# Altium project ASM2464PD USB4 to PCIe M.2.PrjPcb
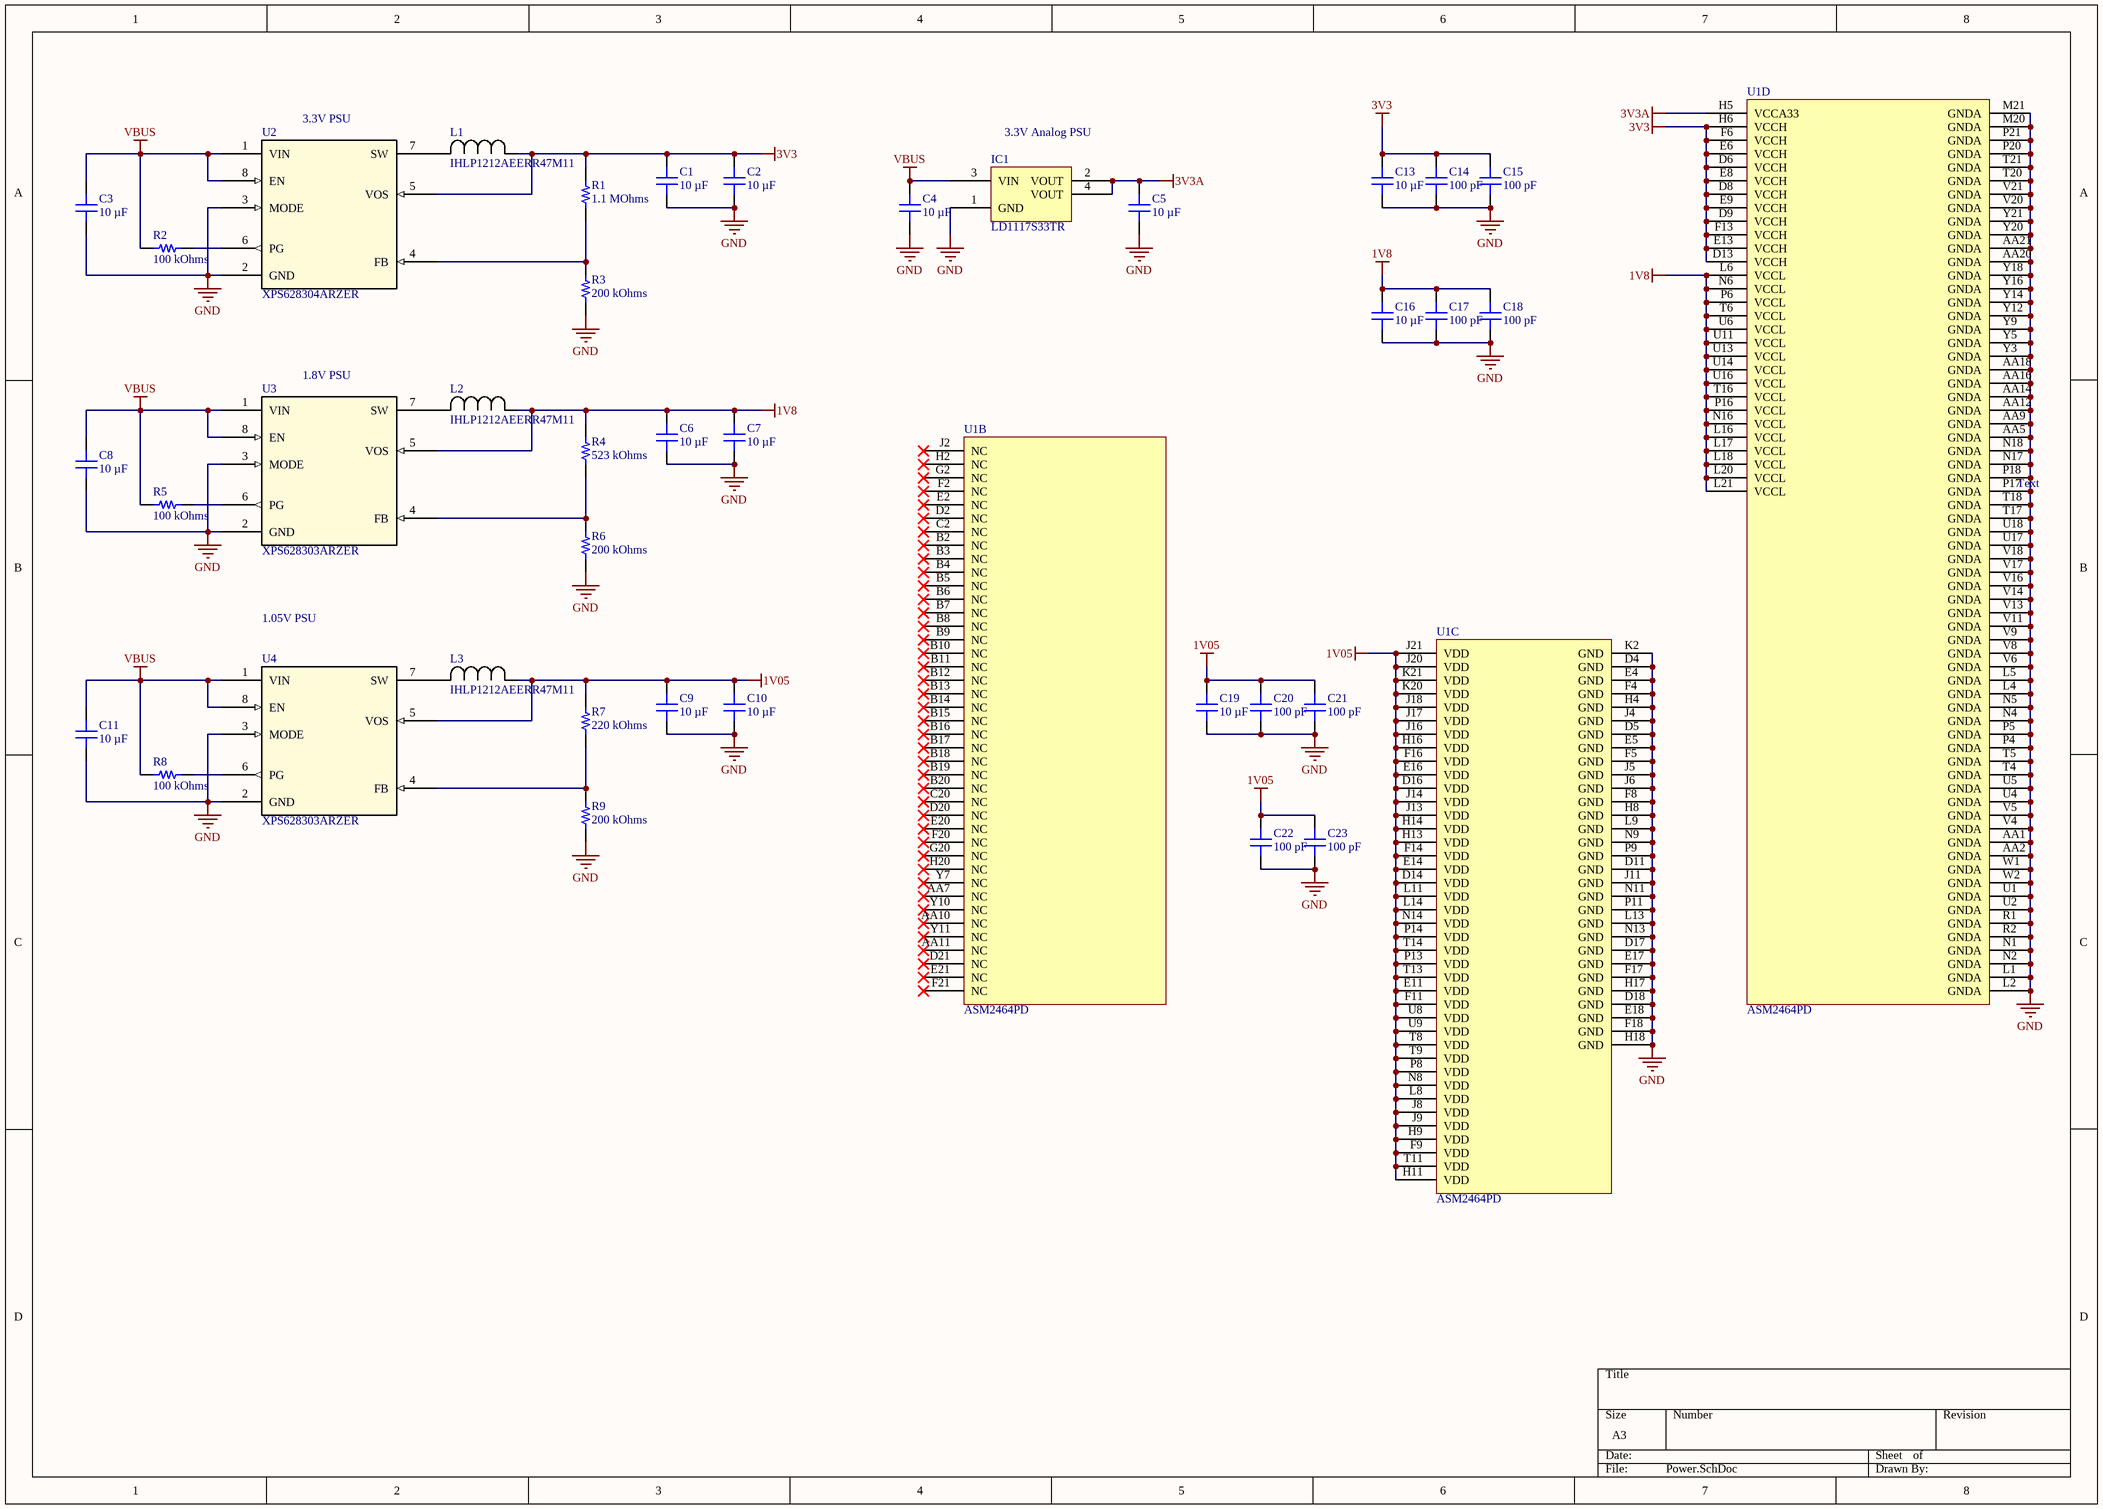
[diagram p0: Power.SchDoc]
CAGE_CODE: ?????; CONTRACT_NUMBER: <CONTRACT NO>; DOC_NO_ASSY_DWG: <ASSY DWG NO>; DOC_NO_BOM: <BOM DOC NO>; DOC_NO_FAB_DWG: <FAB DWG NO>; DOC_NO_SCH_DWG: <SCH DWG NO>; PCB_2_DEC_TOL: +/-.01; PCB_3_DEC_TOL: +/-.010; PCB_ANG_TOL: +/-1/2; PCB_ASSEMBLY_NO: <PCB ASSY NO>; PCB_CHECKER: - -----; PCB_CHECKER_APP_DATE: --/--/----; PCB_DESIGNER: - -----; PCB_DESIGNER_APP_DATE: --/--/----; PCB_DWG_NO: <PCB DWG NO>; PCB_ENGINEER: - -----; PCB_ENGINEER_APP_DATE: --/--/----; PCB_PART_NUMBER: <PCB PN>; PCB_REV: A; SCH_REV: A
2 sheets, 68 parts. Net scope: global (net labels, ports and power ports of the same name join across sheets).
Board file: PCB2.PcbDoc
Sheets:
  Power.SchDoc
  Main.SchDoc

## Sheet Power.SchDoc
size A3; SheetNumber: 1; SheetTotal: 2

### Parts
C1  10 µF  [CAP 0805_2012]
C2  10 µF  [CAP 0805_2012]
C3  10 µF  [CAP 0805_2012]
C4  10 µF  [CAP 0805_2012]
C5  10 µF  [CAP 0805_2012]
C6  10 µF  [CAP 0805_2012]
C7  10 µF  [CAP 0805_2012]
C8  10 µF  [CAP 0805_2012]
C9  10 µF  [CAP 0805_2012]
C10  10 µF  [CAP 0805_2012]
C11  10 µF  [CAP 0805_2012]
C13  10 µF  [CAP 0805_2012]
C14  100 pF  [CAP 0603_1608]
C15  100 pF  [CAP 0603_1608]
C16  10 µF  [CAP 0805_2012]
C17  100 pF  [CAP 0603_1608]
C18  100 pF  [CAP 0603_1608]
C19  10 µF  [CAP 0805_2012]
C20  100 pF  [CAP 0603_1608]
C21  100 pF  [CAP 0603_1608]
C22  100 pF  [CAP 0603_1608]
C23  100 pF  [CAP 0603_1608]
IC1  LD1117S33TR  [ST SOT-223]
L1  IHLP1212AEERR47M11  [IND_IHLP-1212AE_VIS]
L2  IHLP1212AEERR47M11  [IND_IHLP-1212AE_VIS]
L3  IHLP1212AEERR47M11  [IND_IHLP-1212AE_VIS]
R1  1.1 MOhms  [RES 0805_2012]
R2  100 kOhms  [RES 0805_2012]
R3  200 kOhms  [RES 0805_2012]
R4  523 kOhms  [RES 0805_2012]
R5  100 kOhms  [RES 0805_2012]
R6  200 kOhms  [RES 0805_2012]
R7  220 kOhms  [RES 0805_2012]
R8  100 kOhms  [RES 0805_2012]
R9  200 kOhms  [RES 0805_2012]
U1  ASM2464PD  [BGA273C46P21X21_1000X1000X98_2]  (parts B,C,D of 4)
U2  XPS628304ARZER  [WQFN-HR8_RZE_TEX]
U3  XPS628303ARZER  [WQFN-HR8_RZE_TEX]
U4  XPS628303ARZER  [WQFN-HR8_RZE_TEX]

### Nets
1V05: C9.2 C10.2 C19.2 C20.2 C21.2 C22.2 C23.2 L3.1 R7.2 U1.D14(VDD) U1.D16(VDD) U1.E11(VDD) U1.E14(VDD) U1.E16(VDD) U1.F9(VDD) U1.F11(VDD) U1.F14(VDD) U1.F16(VDD) U1.H9(VDD) U1.H11(VDD) U1.H13(VDD) U1.H14(VDD) U1.H16(VDD) U1.J8(VDD) U1.J9(VDD) U1.J13(VDD) U1.J14(VDD) U1.J16(VDD) U1.J17(VDD) U1.J18(VDD) U1.J20(VDD) U1.J21(VDD) U1.K20(VDD) U1.K21(VDD) U1.L8(VDD) U1.L11(VDD) U1.L14(VDD) U1.N8(VDD) U1.N14(VDD) U1.P8(VDD) U1.P13(VDD) U1.P14(VDD) U1.T8(VDD) U1.T9(VDD) U1.T11(VDD) U1.T13(VDD) U1.T14(VDD) U1.U8(VDD) U1.U9(VDD) U4.5(VOS)
1V8: C6.2 C7.2 C16.2 C17.2 C18.2 L2.1 R4.2 U1.L6(VCCL) U1.L16(VCCL) U1.L17(VCCL) U1.L18(VCCL) U1.L20(VCCL) U1.L21(VCCL) U1.N6(VCCL) U1.N16(VCCL) U1.P6(VCCL) U1.P16(VCCL) U1.T6(VCCL) U1.T16(VCCL) U1.U6(VCCL) U1.U11(VCCL) U1.U13(VCCL) U1.U14(VCCL) U1.U16(VCCL) U3.5(VOS)
3V3: C1.2 C2.2 C13.2 C14.2 C15.2 L1.1 R1.2 U1.D6(VCCH) U1.D8(VCCH) U1.D9(VCCH) U1.D13(VCCH) U1.E6(VCCH) U1.E8(VCCH) U1.E9(VCCH) U1.E13(VCCH) U1.F6(VCCH) U1.F13(VCCH) U1.H6(VCCH) U2.5(VOS)
3V3A: C5.2 IC1.2(VOUT) IC1.4(VOUT) U1.H5(VCCA33)
GND: C1.1 C2.1 C3.1 C4.1 C5.1 C6.1 C7.1 C8.1 C9.1 C10.1 C11.1 C13.1 C14.1 C15.1 C16.1 C17.1 C18.1 C19.1 C20.1 C21.1 C22.1 C23.1 IC1.1(GND) R3.1 R6.1 R9.1 U1.AA1(GNDA) U1.AA2(GNDA) U1.AA5(GNDA) U1.AA9(GNDA) U1.AA12(GNDA) U1.AA14(GNDA) U1.AA16(GNDA) U1.AA18(GNDA) U1.AA20(GNDA) U1.AA21(GNDA) U1.D4(GND) U1.D5(GND) U1.D11(GND) U1.D17(GND) U1.D18(GND) U1.E4(GND) U1.E5(GND) U1.E17(GND) U1.E18(GND) U1.F4(GND) U1.F5(GND) U1.F8(GND) U1.F17(GND) U1.F18(GND) U1.H4(GND) U1.H8(GND) U1.H17(GND) U1.H18(GND) U1.J4(GND) U1.J5(GND) U1.J6(GND) U1.J11(GND) U1.K2(GND) U1.L1(GNDA) U1.L2(GNDA) U1.L4(GNDA) U1.L5(GNDA) U1.L9(GND) U1.L13(GND) U1.M20(GNDA) U1.M21(GNDA) U1.N1(GNDA) U1.N2(GNDA) U1.N4(GNDA) U1.N5(GNDA) U1.N9(GND) U1.N11(GND) U1.N13(GND) U1.N17(GNDA) U1.N18(GNDA) U1.P4(GNDA) U1.P5(GNDA) U1.P9(GND) U1.P11(GND) U1.P17(GNDA) U1.P18(GNDA) U1.P20(GNDA) U1.P21(GNDA) U1.R1(GNDA) U1.R2(GNDA) U1.T4(GNDA) U1.T5(GNDA) U1.T17(GNDA) U1.T18(GNDA) U1.T20(GNDA) U1.T21(GNDA) U1.U1(GNDA) U1.U2(GNDA) U1.U4(GNDA) U1.U5(GNDA) U1.U17(GNDA) U1.U18(GNDA) U1.V4(GNDA) U1.V5(GNDA) U1.V6(GNDA) U1.V8(GNDA) U1.V9(GNDA) U1.V11(GNDA) U1.V13(GNDA) U1.V14(GNDA) U1.V16(GNDA) U1.V17(GNDA) U1.V18(GNDA) U1.V20(GNDA) U1.V21(GNDA) U1.W1(GNDA) U1.W2(GNDA) U1.Y3(GNDA) U1.Y5(GNDA) U1.Y9(GNDA) U1.Y12(GNDA) U1.Y14(GNDA) U1.Y16(GNDA) U1.Y18(GNDA) U1.Y20(GNDA) U1.Y21(GNDA) U2.2(GND) U2.3(MODE) U3.2(GND) U3.3(MODE) U4.2(GND) U4.3(MODE)
VBUS: C3.2 C4.2 C8.2 C11.2 IC1.3(VIN) R2.1 R5.1 R8.1 U2.1(VIN) U2.8(EN) U3.1(VIN) U3.8(EN) U4.1(VIN) U4.8(EN)
NetL1_2: L1.2 U2.7(SW)
NetL2_2: L2.2 U3.7(SW)
NetL3_2: L3.2 U4.7(SW)
NetR1_1: R1.1 R3.2 U2.4(FB)
NetR2_2: R2.2 U2.6(PG)
NetR4_1: R4.1 R6.2 U3.4(FB)
NetR5_2: R5.2 U3.6(PG)
NetR7_1: R7.1 R9.2 U4.4(FB)
NetR8_2: R8.2 U4.6(PG)

Not connected (* = marked no-connect by the designer): U1 AA7(NC)* AA10(NC)* AA11(NC)* B2(NC)* B3(NC)* B4(NC)* B5(NC)* B6(NC)* B7(NC)* B8(NC)* B9(NC)* B10(NC)* B11(NC)* B12(NC)* B13(NC)* B14(NC)* B15(NC)* B16(NC)* B17(NC)* B18(NC)* B19(NC)* B20(NC)* C2(NC)* C20(NC)* D2(NC)* D20(NC)* D21(NC)* E2(NC)* E20(NC)* E21(NC)* F2(NC)* F20(NC)* F21(NC)* G2(NC)* G20(NC)* H2(NC)* H20(NC)* J2(NC)* Y7(NC)* Y10(NC)* Y11(NC)*

### Notes on the sheet
- (near U2) 3.3V PSU
- (near IC1) 3.3V Analog PSU
- (near U3) 1.8V PSU
- 1.05V PSU
- (in symbol CMP-015-00009-7, part D) Text

### Library data of the parts
C1-C11 C13 C16 C19 = GRM21BR61C106ME15L: CAP CER 10UF 16V X5R 0805; manufacturer: Murata Electronics; Tolerance: ±20%; Part Number: GRM21BR61C106ME15L; Value: 10 µF; Applications: General Purpose; Capacitance: 10 µF; componentlink1description: Datasheet; componentlink1url: https://search.murata.co.jp/Ceramy/image/img/A01X/G101/ENG/GRM21BR61C106ME15-01.pdf; componentlink2description: DigiKey Link; componentlink2url: https://www.digikey.com/en/products/detail/murata-electronics/GRM21BR61C106ME15L/2546905; Device Package: 0805 (2012 Metric); lastupdated: 9-2-2024 20:15:38; Lifecycle Status: Active; Minimum Order: 1; Mounting Type: Surface Mount, MLCC; Operating Temperature: -55°C ~ 85°C; Package / Case: 0805 (2012 Metric); packaging: TapeAndReel; partid: 14090; Part Status: Active; price: 0.04; series: GRM; Size / Dimension: 0.079" L x 0.049" W (2.00mm x 1.25mm); Supplier 1: DigiKey; Supplier Part Number 1: 490-6474-1-ND; Temperature Coefficient: X5R; Thickness (Max): 0.053" (1.35mm); Voltage - Rated: 16V
C14 C15 C17 C18 C20-C23 = GCM1885G2A101JA16D: CAP CER 100PF 100V X8G 0603; manufacturer: Murata Electronics; Tolerance: ±5%; Part Number: GCM1885G2A101JA16D; Value: 100 pF; Applications: Automotive; Capacitance: 100 pF; componentlink1description: Datasheet; componentlink1url: https://search.murata.co.jp/Ceramy/image/img/A01X/G101/ENG/GCM1885G2A101JA16-01.pdf; componentlink2description: DigiKey Link; componentlink2url: https://www.digikey.com/en/products/detail/murata-electronics/GCM1885G2A101JA16D/13401834; Device Package: 0603 (1608 Metric); lastupdated: 9-2-2024 20:09:40; Lifecycle Status: Active; Minimum Order: 1; Mounting Type: Surface Mount, MLCC; Operating Temperature: -55°C ~ 150°C; Package / Case: 0603 (1608 Metric); packaging: TapeAndReel; partid: 48316; Part Status: Active; price: 0.01; Ratings: AEC-Q200; series: GCM; Size / Dimension: 0.063" L x 0.031" W (1.60mm x 0.80mm); Supplier 1: DigiKey; Supplier Part Number 1: 490-GCM1885G2A101JA16DCT-ND; Temperature Coefficient: X8G; Thickness (Max): 0.035" (0.90mm); Voltage - Rated: 100V
IC1 = LD1117S33TR: IC REG LINEAR 3.3V 800MA SOT223; Manufacturer: STMicroelectronics; Current - Quiescent (Iq): 10 mA; Number of Regulators: 1; Output Configuration: Positive; Output Type: Fixed; Protection Features: Over Current, Over Temperature; PSRR: 75dB (120Hz); Voltage Dropout (Max): 1.2V @ 800mA; Voltage - Input (Max): 15V; Part Number: LD1117S33TR; ComponentLink1Description: Datasheet; ComponentLink1URL: http://www.st.com/content/ccc/resource/technical/document/datasheet/99/3b/7d/91/91/51/4b/be/CD00000544.pdf/files/CD00000544.pdf/jcr:content/translations/en.CD00000544.pdf; ComponentLink2Description: DigiKey Link; ComponentLink2URL: https://www.digikey.com/en/products/detail/stmicroelectronics/LD1117S33TR/585766; Current - Output: 800mA; LastUpdated: 4-2-2024 21:49:54; Lifecycle Status: Active; Minimum Order: 1; Mounting Type: Surface Mount; Operating Temperature: 0°C ~ 125°C; Package / Case: TO-261-4, TO-261AA; Packaging: TapeAndReel; Part Status: Active; Price: 0.21; Series: -; Supplier 1: DigiKey; Supplier Part Number 1: 497-1242-1-ND; Supplier Device Package: SOT-223; Voltage - Output (Min/Fixed): 3.3V
L1-L3 = IHLP1212AEERR47M11: No Description Available; Mfr_Name: Vishay
R1 = ERJ-6GEYJ115V: RES SMD 1.1M OHM 5% 1/8W 0805; Manufacturer: Panasonic Electronic Components; Power (Watts): 0.125W, 1/8W; Temperature Coefficient: -400/ +150ppm/°C; Part Number: ERJ-6GEYJ115V; Value: 1.1 MOhms; ComponentLink1Description: Datasheet; ComponentLink1URL: http://industrial.panasonic.com/www-cgi/jvcr13pz.cgi?E+PZ+3+AOA0001+ERJ6GEYJ115V+7+WW; ComponentLink2Description: DigiKey Link; ComponentLink2URL: https://www.digikey.com/en/products/detail/panasonic-electronic-components/ERJ-6GEYJ115V/83160; Composition: Thick Film; Device Package: 0805 (2012 Metric); Features: Automotive AEC-Q200; Height - Seated (Max): 0.028" (0.70mm); LastUpdated: 8-2-2024 21:02:02; Lifecycle Status: Active; Minimum Order: 1; Number of Terminations: 2; Operating Temperature: -55°C ~ 155°C; Package / Case: 0805 (2012 Metric); Packaging: TapeAndReel; PartId: 36374; Part Status: Active; Price: 0.01; Ratings: AEC-Q200; Resistance: 1.1 MOhms; Series: ERJ-6G; Size / Dimension: 0.079" L x 0.049" W (2.00mm x 1.25mm); Supplier 1: DigiKey; Supplier Part Number 1: P1.1MACT-ND; Supplier Device Package: 0805; Tolerance: ±5%
R2 R5 R8 = CRCW0805100KFKEA: RES SMD 100K OHM 1% 1/8W 0805; Manufacturer: Vishay Dale; Power (Watts): 0.125W, 1/8W; Temperature Coefficient: ±100ppm/°C; Part Number: CRCW0805100KFKEA; Value: 100 kOhms; ComponentLink1Description: Datasheet; ComponentLink1URL: http://www.vishay.com/docs/20035/dcrcwe3.pdf; ComponentLink2Description: DigiKey Link; ComponentLink2URL: https://www.digikey.com/en/products/detail/vishay-dale/CRCW0805100KFKEA/1175865; Composition: Thick Film; Device Package: 0805 (2012 Metric); Features: Automotive AEC-Q200; Height - Seated (Max): 0.020" (0.50mm); LastUpdated: 8-2-2024 21:02:17; Lifecycle Status: Active; Minimum Order: 1; Number of Terminations: 2; Operating Temperature: -55°C ~ 155°C; Package / Case: 0805 (2012 Metric); Packaging: TapeAndReel; PartId: 32640; Part Status: Active; Price: 0.01; Ratings: AEC-Q200; Resistance: 100 kOhms; Series: CRCW; Size / Dimension: 0.079" L x 0.049" W (2.00mm x 1.25mm); Supplier 1: DigiKey; Supplier Part Number 1: 541-100KCCT-ND; Supplier Device Package: 0805; Tolerance: ±1%
R3 R6 R9 = ERJ-6GEYJ204V: RES SMD 200K OHM 5% 1/8W 0805; Manufacturer: Panasonic Electronic Components; Power (Watts): 0.125W, 1/8W; Temperature Coefficient: ±200ppm/°C; Part Number: ERJ-6GEYJ204V; Value: 200 kOhms; ComponentLink1Description: Datasheet; ComponentLink1URL: http://industrial.panasonic.com/www-cgi/jvcr13pz.cgi?E+PZ+3+AOA0001+ERJ6GEYJ204V+7+WW; ComponentLink2Description: DigiKey Link; ComponentLink2URL: https://www.digikey.com/en/products/detail/panasonic-electronic-components/ERJ-6GEYJ204V/83124; Composition: Thick Film; Device Package: 0805 (2012 Metric); Features: Automotive AEC-Q200; Height - Seated (Max): 0.028" (0.70mm); LastUpdated: 8-2-2024 21:02:29; Lifecycle Status: Active; Minimum Order: 1; Number of Terminations: 2; Operating Temperature: -55°C ~ 155°C; Package / Case: 0805 (2012 Metric); Packaging: TapeAndReel; PartId: 30086; Part Status: Active; Price: 0.01; Ratings: AEC-Q200; Resistance: 200 kOhms; Series: ERJ-6G; Size / Dimension: 0.079" L x 0.049" W (2.00mm x 1.25mm); Supplier 1: DigiKey; Supplier Part Number 1: P200KACT-ND; Supplier Device Package: 0805; Tolerance: ±5%
R4 = ERJ-6ENF5233V: RES SMD 523K OHM 1% 1/8W 0805; Manufacturer: Panasonic Electronic Components; Power (Watts): 0.125W, 1/8W; Temperature Coefficient: ±100ppm/°C; Part Number: ERJ-6ENF5233V; Value: 523 kOhms; ComponentLink1Description: Datasheet; ComponentLink1URL: https://industrial.panasonic.com/cdbs/www-data/pdf/RDA0000/AOA0000C304.pdf; ComponentLink2Description: DigiKey Link; ComponentLink2URL: https://www.digikey.com/en/products/detail/panasonic-electronic-components/ERJ-6ENF5233V/112137; Composition: Thick Film; Device Package: 0805 (2012 Metric); Features: Automotive AEC-Q200; Height - Seated (Max): 0.028" (0.70mm); LastUpdated: 8-2-2024 21:01:04; Lifecycle Status: Active; Minimum Order: 1; Number of Terminations: 2; Operating Temperature: -55°C ~ 155°C; Package / Case: 0805 (2012 Metric); Packaging: TapeAndReel; PartId: 47846; Part Status: Active; Price: 0.01; Ratings: AEC-Q200; Resistance: 523 kOhms; Series: ERJ-6EN; Size / Dimension: 0.079" L x 0.049" W (2.00mm x 1.25mm); Supplier 1: DigiKey; Supplier Part Number 1: P523KCCT-ND; Supplier Device Package: 0805; Tolerance: ±1%
R7 = ERJ-6GEYJ224V: RES SMD 220K OHM 5% 1/8W 0805; Manufacturer: Panasonic Electronic Components; Power (Watts): 0.125W, 1/8W; Temperature Coefficient: ±200ppm/°C; Part Number: ERJ-6GEYJ224V; Value: 220 kOhms; ComponentLink1Description: Datasheet; ComponentLink1URL: http://industrial.panasonic.com/www-cgi/jvcr13pz.cgi?E+PZ+3+AOA0001+ERJ6GEYJ224V+7+WW; ComponentLink2Description: DigiKey Link; ComponentLink2URL: https://www.digikey.com/en/products/detail/panasonic-electronic-components/ERJ-6GEYJ224V/83126; Composition: Thick Film; Device Package: 0805 (2012 Metric); Features: Automotive AEC-Q200; Height - Seated (Max): 0.028" (0.70mm); LastUpdated: 8-2-2024 21:02:29; Lifecycle Status: Active; Minimum Order: 1; Number of Terminations: 2; Operating Temperature: -55°C ~ 155°C; Package / Case: 0805 (2012 Metric); Packaging: TapeAndReel; PartId: 30073; Part Status: Active; Price: 0.01; Ratings: AEC-Q200; Resistance: 220 kOhms; Series: ERJ-6G; Size / Dimension: 0.079" L x 0.049" W (2.00mm x 1.25mm); Supplier 1: DigiKey; Supplier Part Number 1: P220KACT-ND; Supplier Device Package: 0805; Tolerance: ±5%
U1 = CMP-015-00009-7: ASM2464PD, is a new generation of USB4 ®/Thunderbolt to PCIe/NVMe Accessory controller based on ASMedia in-house designed PHYs.; Reference: U; Design Item ID: ASM2464PD; Value: ASM2464PD
U2 = XPS628304ARZER: No Description Available; Mfr_Name: Texas Instruments; Type: Power Management; RefDes: RefDes
U3 U4 = XPS628303ARZER: No Description Available; Mfr_Name: Texas Instruments; Type: Power Management; RefDes: RefDes

## Sheet Main.SchDoc
size 431 x 279 mm; SheetNumber: 2; SheetTotal: 2; ENG_APP_DATE: --/--/--; DSN_APP_DATE: --/--/--; CHK_APP_DATE: --/--/--
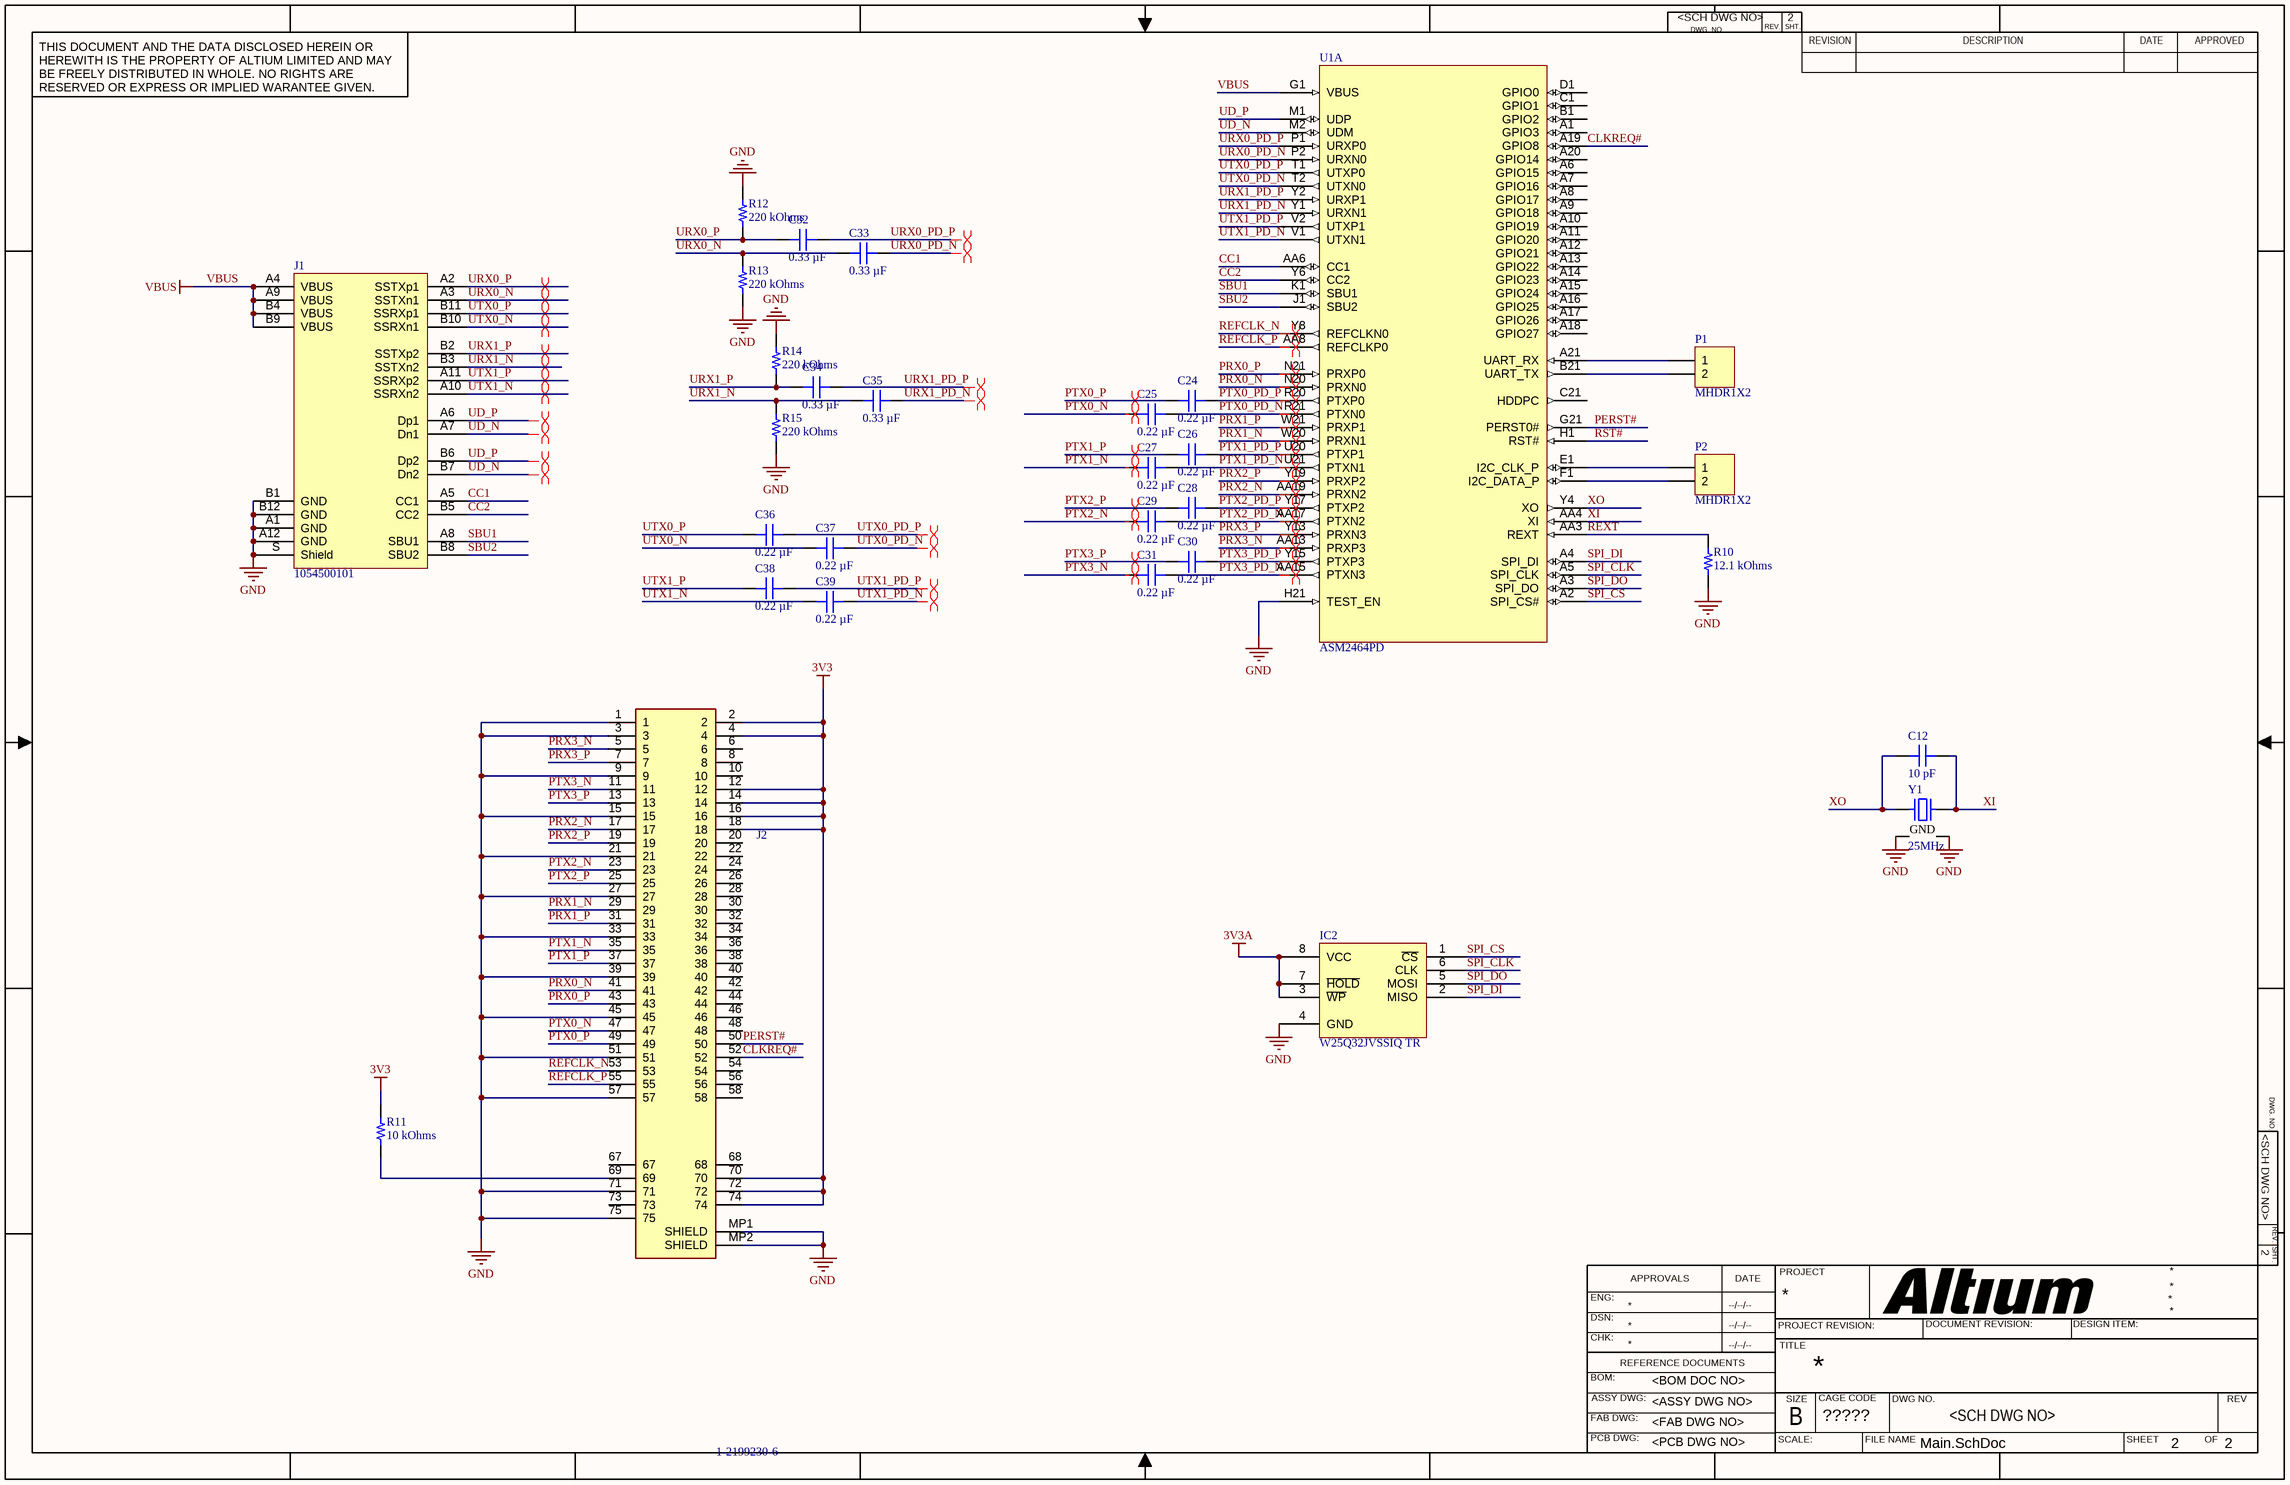
[diagram p1: Main.SchDoc]

### Parts
C12  10 pF  [CAP 0603_1608]
C24  0.22 µF  [CAP 0402_1005]
C25  0.22 µF  [CAP 0402_1005]
C26  0.22 µF  [CAP 0402_1005]
C27  0.22 µF  [CAP 0402_1005]
C28  0.22 µF  [CAP 0402_1005]
C29  0.22 µF  [CAP 0402_1005]
C30  0.22 µF  [CAP 0402_1005]
C31  0.22 µF  [CAP 0402_1005]
C32  0.33 µF  [CAP 0201_0603]
C33  0.33 µF  [CAP 0201_0603]
C34  0.33 µF  [CAP 0201_0603]
C35  0.33 µF  [CAP 0201_0603]
C36  0.22 µF  [CAP 0201_0603]
C37  0.22 µF  [CAP 0201_0603]
C38  0.22 µF  [CAP 0201_0603]
C39  0.22 µF  [CAP 0201_0603]
IC2  W25Q32JVSSIQ TR  [WINBOND SOIC-8 208MIL WIDE]
J1  1054500101  [Molex 1054500101]
J2  1-2199230-6  [121992306]
P1  MHDR1X2  [MHDR1X2]
P2  MHDR1X2  [MHDR1X2]
R10  12.1 kOhms  [RES 0603_1608]
R11  10 kOhms  [RES 0805_2012]
R12  220 kOhms  [RES 0201_0603]
R13  220 kOhms  [RES 0201_0603]
R14  220 kOhms  [RES 0201_0603]
R15  220 kOhms  [RES 0201_0603]
U1  ASM2464PD  [BGA273C46P21X21_1000X1000X98_2]  (part A of 4)
Y1  25MHz  [ABRACON ABM8G]

### Nets
3V3: J2.2 J2.4 J2.12 J2.14 J2.16 J2.18 J2.70 J2.72 J2.74 R11.2
3V3A: IC2.3(~{WP}) IC2.7(~{HOLD}) IC2.8(VCC)
GND: IC2.4(GND) J1.A1(GND) J1.A12(GND) J1.B1(GND) J1.B12(GND) J1.S(Shield) J2.1 J2.3 J2.9 J2.15 J2.21 J2.27 J2.33 J2.39 J2.45 J2.51 J2.57 J2.71 J2.75 J2.MP1(SHIELD) J2.MP2(SHIELD) R10.1 R12.2 R13.1 R14.2 R15.2 U1.H21(TEST_EN) Y1.2(GND) Y1.4(GND)
VBUS: J1.A4(VBUS) J1.A9(VBUS) J1.B4(VBUS) J1.B9(VBUS) U1.G1(VBUS)
CC1: J1.A5(CC1) U1.AA6(CC1)
CC2: J1.B5(CC2) U1.Y6(CC2)
CLKREQ#: J2.52 U1.A19(GPIO8)
PERST#: J2.50 U1.G21(PERST0#)
PRX0_N: J2.41 U1.N20(PRXN0)
PRX0_P: J2.43 U1.N21(PRXP0)
PRX1_N: J2.29 U1.W20(PRXN1)
PRX1_P: J2.31 U1.W21(PRXP1)
PRX2_N: J2.17 U1.AA19(PRXN2)
PRX2_P: J2.19 U1.Y19(PRXP2)
PRX3_N: J2.5 U1.AA13(PRXP3)
PRX3_P: J2.7 U1.Y13(PRXN3)
PTX0_N: C25.1 J2.47
PTX0_P: C24.1 J2.49
PTX0_PD_N: C25.2 U1.R21(PTXN0)
PTX0_PD_P: C24.2 U1.R20(PTXP0)
PTX1_N: C27.1 J2.35
PTX1_P: C26.1 J2.37
PTX1_PD_N: C27.2 U1.U21(PTXN1)
PTX1_PD_P: C26.2 U1.U20(PTXP1)
PTX2_N: C29.1 J2.23
PTX2_P: C28.1 J2.25
PTX2_PD_N: C29.2 U1.AA17(PTXN2)
PTX2_PD_P: C28.2 U1.Y17(PTXP2)
PTX3_N: C31.1 J2.11
PTX3_P: C30.1 J2.13
PTX3_PD_N: C31.2 U1.AA15(PTXN3)
PTX3_PD_P: C30.2 U1.Y15(PTXP3)
REFCLK_N: J2.53 U1.Y8(REFCLKN0)
REFCLK_P: J2.55 U1.AA8(REFCLKP0)
REXT: R10.2 U1.AA3(REXT)
RST#: U1.H1(RST#)
SBU1: J1.A8(SBU1) U1.K1(SBU1)
SBU2: J1.B8(SBU2) U1.J1(SBU2)
SPI_CLK: IC2.6(CLK) U1.A5(SPI_CLK)
SPI_CS: IC2.1(~{CS}) U1.A2(SPI_CS#)
SPI_DI: IC2.2(MISO) U1.A4(SPI_DI)
SPI_DO: IC2.5(MOSI) U1.A3(SPI_DO)
UD_N: J1.A7(Dn1) J1.B7(Dn2) U1.M2(UDM)
UD_P: J1.A6(Dp1) J1.B6(Dp2) U1.M1(UDP)
URX0_N: C33.1 J1.A3(SSTXn1) R13.2
URX0_P: C32.1 J1.A2(SSTXp1) R12.1
URX0_PD_N: C33.2 U1.P2(URXN0)
URX0_PD_P: C32.2 U1.P1(URXP0)
URX1_N: C35.1 J1.B3(SSTXn2) R15.1
URX1_P: C34.1 J1.B2(SSTXp2) R14.1
URX1_PD_N: C35.2 U1.Y1(URXN1)
URX1_PD_P: C34.2 U1.Y2(URXP1)
UTX0_N: C37.1 J1.B10(SSRXn1)
UTX0_P: C36.1 J1.B11(SSRXp1)
UTX0_PD_N: C37.2 U1.T2(UTXN0)
UTX0_PD_P: C36.2 U1.T1(UTXP0)
UTX1_N: C39.1 J1.A10(SSRXn2)
UTX1_P: C38.1 J1.A11(SSRXp2)
UTX1_PD_N: C39.2 U1.V1(UTXN1)
UTX1_PD_P: C38.2 U1.V2(UTXP1)
XI: C12.2 U1.AA4(XI) Y1.3
XO: C12.1 U1.Y4(XO) Y1.1
NetJ2_69: J2.69 R11.1
NetP1_1: P1.1 U1.A21(UART_RX)
NetP1_2: P1.2 U1.B21(UART_TX)
NetP2_1: P2.1 U1.E1(I2C_CLK_P)
NetP2_2: P2.2 U1.F1(I2C_DATA_P)

Not connected (* = marked no-connect by the designer): J2 6 8 10 20 22 24 26 28 30 32 34 36 38 40 42 44 46 48 54 56 58 67 68 73; U1 A1(GPIO3) A6(GPIO15) A7(GPIO16) A8(GPIO17) A9(GPIO18) A10(GPIO19) A11(GPIO20) A12(GPIO21) A13(GPIO22) A14(GPIO23) A15(GPIO24) A16(GPIO25) A17(GPIO26) A18(GPIO27) A20(GPIO14) B1(GPIO2) C1(GPIO1) C21(HDDPC) D1(GPIO0)

### Layout directives
differential pair; differential pair class D90: UD_N, UD_P, URX0_N, URX0_P, URX1_N, URX1_P, UTX0_N, UTX0_P, UTX1_N, UTX1_P
differential pair; differential pair class D100: PRX0_N, PRX0_P, PRX1_N, PRX1_P, PRX2_N, PRX2_P, PRX3_N, PRX3_P, PTX0_N, PTX0_P, PTX0_PD_N, PTX0_PD_P, PTX1_N, PTX1_P, PTX1_PD_N, PTX1_PD_P, PTX2_N, PTX2_P, PTX2_PD_N, PTX2_PD_P, PTX3_N, PTX3_P, PTX3_PD_N, PTX3_PD_P, REFCLK_N, REFCLK_P, URX0_PD_N, URX0_PD_P, URX1_PD_N, URX1_PD_P, UTX0_PD_N, UTX0_PD_P, UTX1_PD_N, UTX1_PD_P

### Notes on the sheet
- DWG. NO.
- REV.
- SHT.
- THIS DOCUMENT AND THE DATA DISCLOSED HEREIN OR HEREWITH IS THE PROPERTY OF ALTIUM LIMITED AND MAY BE FREELY DISTRIBUTED IN WHOLE. NO RIGHTS ARE RESERVED OR EXPRESS OR IMPLIED WARANTEE GIVEN.
- REVISION
- DESCRIPTION
- DATE
- APPROVED
- ENG:
- APPROVALS
- PROJECT
- DSN:
- CHK:
- REFERENCE DOCUMENTS
- PROJECT REVISION:
- TITLE
- DOCUMENT REVISION:
- DESIGN ITEM:
- BOM:
- FAB DWG:
- PCB DWG:
- ASSY DWG:
- SCALE:
- SIZE
- B
- CAGE CODE
- FILE NAME
- DWG NO.
- SHEET
- OF
- REV

### Library data of the parts
C12 = CC0603JRNPOABN100: CAP CER 10PF 200V C0G/NPO 0603; manufacturer: Yageo; Temperature Coefficient: C0G, NP0; Tolerance: ±5%; Part Number: CC0603JRNPOABN100; Value: 10 pF; Applications: General Purpose; Capacitance: 10 pF; componentlink1description: Datasheet; componentlink1url: https://www.yageo.com/upload/media/product/products/datasheet/mlcc/UPY-NP0X7R_MV_100-to-630V_21.pdf; componentlink2description: DigiKey Link; componentlink2url: https://www.digikey.com/en/products/detail/yageo/CC0603JRNPOABN100/5883628; Device Package: 0603 (1608 Metric); lastupdated: 9-2-2024 20:09:51; Lifecycle Status: Active; Minimum Order: 1; Mounting Type: Surface Mount, MLCC; Operating Temperature: -55°C ~ 125°C; Package / Case: 0603 (1608 Metric); packaging: TapeAndReel; partid: 42031; Part Status: Active; price: 0.01; series: CC; Size / Dimension: 0.063" L x 0.031" W (1.60mm x 0.80mm); Supplier 1: DigiKey; Supplier Part Number 1: 13-CC0603JRNPOABN100CT-ND; Thickness (Max): 0.035" (0.90mm); Voltage - Rated: 200V
C24-C31 = GRM155C8YA224KE01J: CAP CER 0.22UF 35V X6S 0402; manufacturer: Murata Electronics; Tolerance: ±10%; Part Number: GRM155C8YA224KE01J; Value: 0.22 µF; Applications: General Purpose; Capacitance: 0.22 µF; componentlink1description: Datasheet; componentlink1url: https://search.murata.co.jp/Ceramy/image/img/A01X/G101/ENG/GRM155C8YA224KE01-01A.pdf; componentlink2description: DigiKey Link; componentlink2url: https://www.digikey.com/en/products/detail/murata-electronics/GRM155C8YA224KE01J/10693050; Device Package: 0402 (1005 Metric); lastupdated: 9-2-2024 20:03:29; Lifecycle Status: Active; Minimum Order: 1; Mounting Type: Surface Mount, MLCC; Operating Temperature: -55°C ~ 105°C; Package / Case: 0402 (1005 Metric); packaging: TapeAndReel; partid: 55010; Part Status: Active; price: 0.01; series: GRM; Size / Dimension: 0.039" L x 0.020" W (1.00mm x 0.50mm); Supplier 1: DigiKey; Supplier Part Number 1: 490-GRM155C8YA224KE01JCT-ND; Temperature Coefficient: X6S; Thickness (Max): 0.022" (0.55mm); Voltage - Rated: 35V
C32-C35 = GRM033R60J334ME90D: CAP CER 0.33UF 6.3V X5R 0201; manufacturer: Murata Electronics; Tolerance: ±20%; Part Number: GRM033R60J334ME90D; Value: 0.33 µF; Applications: General Purpose; Capacitance: 0.33 µF; componentlink1description: Datasheet; componentlink1url: https://search.murata.co.jp/Ceramy/image/img/A01X/G101/ENG/GRM033R60J334ME90-01.pdf; componentlink2description: DigiKey Link; componentlink2url: https://www.digikey.com/en/products/detail/murata-electronics/GRM033R60J334ME90D/5027493; Device Package: 0201 (0603 Metric); lastupdated: 11-3-2024 07:01:48; Lifecycle Status: Active; Minimum Order: 1; Mounting Type: Surface Mount; Operating Temperature: -55°C ~ 85°C; Package / Case: 0201 (0603 Metric); packaging: TapeAndReel; partid: 1094; Part Status: Active; price: 0.01; series: GRM; Size / Dimension: 0.024" L x 0.012" W (0.60mm x 0.30mm); Supplier 1: DigiKey; Supplier Part Number 1: 490-10408-1-ND; Temperature Coefficient: X5R; Thickness (Max): 0.013" (0.33mm); Voltage - Rated: 6.3V
C36-C39 = GRM033R61E224KE01J: CAP CER 0.22UF 25V X5R 0201; manufacturer: Murata Electronics; Tolerance: ±10%; Part Number: GRM033R61E224KE01J; Value: 0.22 µF; Applications: General Purpose; Capacitance: 0.22 µF; componentlink2description: DigiKey Link; componentlink2url: https://www.digikey.com/en/products/detail/murata-electronics/GRM033R61E224KE01J/10690160; Device Package: 0201 (0603 Metric); lastupdated: 11-3-2024 07:01:28; Lifecycle Status: Active; Minimum Order: 1; Mounting Type: Surface Mount, MLCC; Operating Temperature: -55°C ~ 85°C; Package / Case: 0201 (0603 Metric); packaging: CutTape; partid: 55140; Part Status: Active; price: 0.01; series: GRM; Size / Dimension: 0.024" L x 0.012" W (0.60mm x 0.30mm); Supplier 1: DigiKey; Supplier Part Number 1: 490-GRM033R61E224KE01JCT-ND; Temperature Coefficient: X5R; Thickness (Max): 0.013" (0.33mm); Voltage - Rated: 25V
IC2 = W25Q32JVSSIQ TR: IC FLASH 32M SPI 133MHZ 8SOIC; Manufacturer: Winbond Electronics; Memory Interface: SPI - Quad I/O; Memory Size: 32Mb (4M x 8); Memory Type: Non-Volatile; Voltage - Supply: 2.7V ~ 3.6V; Write Cycle Time - Word, Page: 3ms; Part Number: W25Q32JVSSIQ TR; Clock Frequency: 133MHz; ComponentLink1Description: Datasheet; ComponentLink1URL: http://www.winbond.com/resource-files/w25q32jv%20revg%2003272018%20plus.pdf; ComponentLink2Description: DigiKey Link; ComponentLink2URL: http://digikey.com/product-detail/en/winbond-electronics/W25Q32JVSSIQ-TR/W25Q32JVSSIQCT-ND/7393546; Device Package: 8-SOIC (0.209", 5.30mm Width); LastUpdated: 30-3-2020 15:35:36; Lifecycle Status: Active; Memory Format: FLASH; Minimum Order: 1; Mounting Type: Surface Mount; Operating Temperature: -40°C ~ 85°C (TA); Package / Case: 8-SOIC (0.209", 5.30mm Width); Packaging: TapeAndReel; PartId: 857; Part Status: Active; Price: 0.54; Series: SpiFlash®; Supplier 1: DigiKey; Supplier Part Number 1: W25Q32JVSSIQCT-ND; Supplier Device Package: 8-SOIC; Technology: FLASH - NOR
J1 = 1054500101: CONN RCP USB3.1 TYPEC 24P SMD RA; Manufacturer: Molex; Connector Type: USB - C (Type - C); Current Rating (Amps): 0.25A, 1A, 5A; Gender: Receptacle; Mating Cycles: 10000; Number of Contacts: 24; Number of Ports: 1; Shielding: Shielded; Specifications: USB 3.1 (USB 3.1 Gen 2, Superspeed+); Voltage - Rated: 30VAC/DC; Part Number: 1054500101; ComponentLink1Description: Datasheet; ComponentLink1URL: https://www.molex.com/pdm_docs/ps/PS-105448-001.pdf; ComponentLink2Description: DigiKey Link; ComponentLink2URL: http://digikey.com/product-detail/en/molex/1054500101/WM12856CT-ND/5843891; LastUpdated: 6-6-2020 02:14:04; Lifecycle Status: Active; Minimum Order: 1; Mounting Feature: Horizontal; Mounting Type: Surface Mount, Right Angle; Through Hole; Operating Temperature: -30°C ~ 85°C; Packaging: TapeAndReel; Part Status: Active; Price: 1.22; Series: 105445; Supplier 1: DigiKey; Supplier Part Number 1: WM12856CT-ND; Termination: Solder
J2 = 1-2199230-6: M.2 0.5PITCH 4.2H KEY M 30U AU; MF: TE Connectivity; Package: None; Digi-Key_Part_Number: A118046TR-ND; Purchase-URL: https://pricing.snapeda.com/search/part/1-2199230-6/?ref=eda; Check_prices: https://www.snapeda.com/parts/1-2199230-6/TE+Connectivity+AMP+Connectors/view-part/?ref=eda; MP: 1-2199230-6; SnapEDA_Link: https://www.snapeda.com/parts/1-2199230-6/TE+Connectivity+AMP+Connectors/view-part/?ref=snap; Value: *
P1 P2 = MHDR1X2: Header, 2-Pin; LatestRevisionDate: 17-Jul-2002; LatestRevisionNote: Re-released for DXP Platform.; Publisher: Altium Limited
R10 = RNCS0603BKE12K1: RES 12.1K OHM 0.1% 1/16W 0603; Manufacturer: Stackpole Electronics Inc; Power (Watts): 0.063W, 1/16W; Temperature Coefficient: ±25ppm/°C; Part Number: RNCS0603BKE12K1; Value: 12.1 kOhms; ComponentLink1Description: Datasheet; ComponentLink1URL: https://www.seielect.com/catalog/sei-rncs_rnch.pdf; ComponentLink2Description: DigiKey Link; ComponentLink2URL: https://www.digikey.com/en/products/detail/stackpole-electronics-inc/RNCS0603BKE12K1/1799989; Composition: Thin Film; Device Package: 0603 (1608 Metric); Features: Anti-Corrosive, Automotive AEC-Q200, Moisture Resistant; Height - Seated (Max): 0.022" (0.55mm); LastUpdated: 9-2-2024 20:43:23; Lifecycle Status: Active; Minimum Order: 1; Number of Terminations: 2; Operating Temperature: -55°C ~ 155°C; Package / Case: 0603 (1608 Metric); Packaging: TapeAndReel; PartId: 8189; Part Status: Active; Price: 0.06; Ratings: AEC-Q200; Resistance: 12.1 kOhms; Series: RNCS; Size / Dimension: 0.061" L x 0.031" W (1.55mm x 0.80mm); Supplier 1: DigiKey; Supplier Part Number 1: RNCS0603BKE12K1CT-ND; Supplier Device Package: 0603; Tolerance: ±0.1%
R11 = CR0805-FX-1002ELF: RES SMD 10K OHM 1% 1/8W 0805; Manufacturer: Bourns Inc.; Power (Watts): 0.125W, 1/8W; Temperature Coefficient: ±100ppm/°C; Part Number: CR0805-FX-1002ELF; Value: 10 kOhms; ComponentLink1Description: Datasheet; ComponentLink1URL: https://www.bourns.com/docs/Product-Datasheets/CHPREZTR.pdf; ComponentLink2Description: DigiKey Link; ComponentLink2URL: https://www.digikey.com/en/products/detail/bourns-inc/CR0805-FX-1002ELF/3593209; Composition: Thick Film; Device Package: 0805 (2012 Metric); Features: Moisture Resistant; Height - Seated (Max): 0.024" (0.60mm); LastUpdated: 8-2-2024 21:01:26; Lifecycle Status: Active; Minimum Order: 1; Number of Terminations: 2; Operating Temperature: -55°C ~ 155°C; Package / Case: 0805 (2012 Metric); Packaging: CutTape; PartId: 44694; Part Status: Active; Price: 0.01; Resistance: 10 kOhms; Series: CR0805; Size / Dimension: 0.079" L x 0.049" W (2.00mm x 1.25mm); Supplier 1: DigiKey; Supplier Part Number 1: CR0805-FX-1002ELFCT-ND; Supplier Device Package: 0805; Tolerance: ±1%
R12-R15 = ERJ-1GNF2203C: RES SMD 220K OHM 1% 1/20W 0201; Manufacturer: Panasonic Electronic Components; Power (Watts): 0.05W, 1/20W; Temperature Coefficient: ±200ppm/°C; Part Number: ERJ-1GNF2203C; Value: 220 kOhms; ComponentLink1Description: Datasheet; ComponentLink1URL: https://industrial.panasonic.com/cdbs/www-data/pdf/RDA0000/AOA0000C304.pdf; ComponentLink2Description: DigiKey Link; ComponentLink2URL: https://www.digikey.com/en/products/detail/panasonic-electronic-components/ERJ-1GNF2203C/2036376; Composition: Thick Film; Device Package: 0201 (0603 Metric); Features: Automotive AEC-Q200; Height - Seated (Max): 0.010" (0.26mm); LastUpdated: 11-3-2024 07:14:02; Lifecycle Status: Active; Minimum Order: 1; Number of Terminations: 2; Operating Temperature: -55°C ~ 125°C; Package / Case: 0201 (0603 Metric); Packaging: TapeAndReel; PartId: 822; Part Status: Active; Price: 0.01; Ratings: AEC-Q200; Resistance: 220 kOhms; Series: ERJ-1GN; Size / Dimension: 0.024" L x 0.012" W (0.60mm x 0.30mm); Supplier 1: DigiKey; Supplier Part Number 1: P122834CT-ND; Supplier Device Package: 0201; Tolerance: ±1%
U1 = CMP-015-00009-7: as U1 on sheet Power; Design Item ID: ASM2464PD; Value: ASM2464PD
Y1 = ABM8G-25.000MHZ-18-D2Y-T: CRYSTAL 25.0000MHZ 18PF SMD; Manufacturer: Abracon LLC; ESR (Equivalent Series Resistance): 60 Ohms; Frequency Stability: ±30ppm; Frequency Tolerance: ±20ppm; Operating Mode: Fundamental; Part Number: ABM8G-25.000MHZ-18-D2Y-T; ComponentLink1Description: Datasheet; ComponentLink1URL: https://abracon.com/Resonators/ABM8G.pdf; ComponentLink2Description: DigiKey Link; ComponentLink2URL: http://digikey.com/product-detail/en/abracon-llc/ABM8G-25.000MHZ-18-D2Y-T/535-10275-1-ND/2218088; Device Package: 4-SMD, No Lead; Frequency: 25MHz; Height - Seated (Max): 0.039" (1.00mm); LastUpdated: 19-3-2020 22:36:25; Lifecycle Status: Active; Load Capacitance: 18pF; Minimum Order: 1; Mounting Type: Surface Mount; Operating Temperature: -40°C ~ 85°C; Package / Case: 4-SMD, No Lead; Packaging: TapeAndReel; PartId: 354; Part Status: Active; Price: 0.34; Series: ABM8G; Size / Dimension: 0.126" L x 0.098" W (3.20mm x 2.50mm); Supplier 1: DigiKey; Supplier Part Number 1: 535-10275-1-ND; Type: MHz Crystal; Value: 25MHz

## Nets that join several sheets
3V3: Power (19 pins), Main (10 pins)
3V3A: Power (C5.2 IC1.2 IC1.4 U1.H5), Main (IC2.3 IC2.7 IC2.8)
GND: Power (128 pins), Main (29 pins)
VBUS: Power (14 pins), Main (5 pins)